# Altium schematic sheet SoC_PS_505_GTR.SchDoc: RFSoC AMC
size 420 x 297 mm; CompanyName: WUT; DrawnBy: T. Przywozki; Organization: WUT ISE; Address1: Warsaw University of Technology; Address2: Nowowiejska 15/19 00-665 Warsaw; Address3: Tomasz.Przywozki@pw.edu.pl; DocumentNumber: 11; Revision: 1; SheetNumber: 11; SheetTotal: 45; Project: RFSoC AMC; ModifiedBy: T. Przywozki; CreateDate: -; CheckedDate: -; DivGrp: ISE; Designer: T. Przywozki; ModifiedDate: -; ProjectName: ADC/DAC MEZZANINE
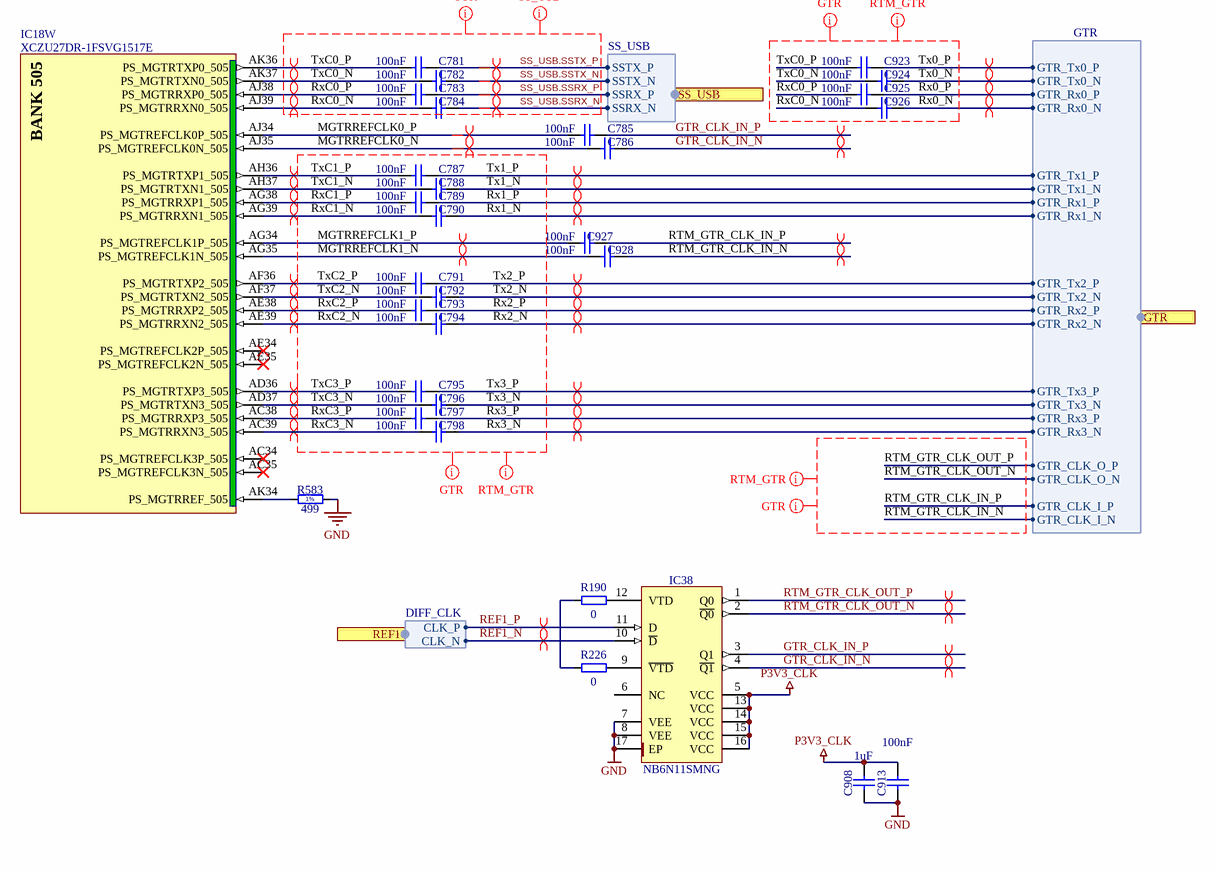
[diagram p0: SoC_PS_505_GTR.SchDoc]

## Parts
C781  100nF  [CAPC0603X33N]
C782  100nF  [CAPC0603X33N]
C783  100nF  [CAPC0603X33N]
C784  100nF  [CAPC0603X33N]
C785  100nF  [CAPC0603X33N]
C786  100nF  [CAPC0603X33N]
C787  100nF  [CAPC0603X33N]
C788  100nF  [CAPC0603X33N]
C789  100nF  [CAPC0603X33N]
C790  100nF  [CAPC0603X33N]
C791  100nF  [CAPC0603X33N]
C792  100nF  [CAPC0603X33N]
C793  100nF  [CAPC0603X33N]
C794  100nF  [CAPC0603X33N]
C795  100nF  [CAPC0603X33N]
C796  100nF  [CAPC0603X33N]
C797  100nF  [CAPC0603X33N]
C798  100nF  [CAPC0603X33N]
C908  1uF  [CAPC1005X55N]
C913  100nF  [CAPC0603X33N]
C923  100nF  [CAPC0603X33N]
C924  100nF  [CAPC0603X33N]
C925  100nF  [CAPC0603X33N]
C926  100nF  [CAPC0603X33N]
C927  100nF  [CAPC0603X33N]
C928  100nF  [CAPC0603X33N]
IC18  XCZU27DR-1FSVG1517E  [XILINX_FSVG1517 (XCZU27DR)]  (part W of 31)
IC38  NB6N11SMNG  [QFN50P300X300X100-17N-S185]
R190  0  [RESC1005X40N]
R226  0  [RESC1005X40N]
R583  499  [RESC1005X40N]

## Ports
GTR (harness GTR), REF1 (in, harness DIFF_CLK), SS_USB (harness SS_USB)

## Harnesses
DIFF_CLK: CLK_P, CLK_N
SS_USB: SSRX_P, SSTX_N, SSTX_P, SSRX_N
GTR: GTR_Tx0_P, GTR_Tx0_N, GTR_Rx0_P, GTR_Rx0_N, GTR_Rx1_P, GTR_Rx1_N, GTR_Tx1_P, GTR_Tx1_N, GTR_Rx2_P, GTR_Rx2_N, GTR_Tx2_P, GTR_Tx2_N, GTR_Rx3_P, GTR_Rx3_N, GTR_Tx3_P, GTR_Tx3_N, GTR_CLK_O_P, GTR_CLK_O_N, GTR_CLK_I_P, GTR_CLK_I_N

## Nets
GND: C908.2 C913.1 IC38.7(VEE) IC38.8(VEE) IC38.17(EP) R583.2
P3V3_CLK: C908.1 C913.2 IC38.5(VCC) IC38.13(VCC) IC38.14(VCC) IC38.15(VCC) IC38.16(VCC)
GTR_CLK_IN_N: C786.2 IC38.4(~{Q1})
GTR_CLK_IN_P: C785.2 IC38.3(Q1)
MGTRREFCLK0_N: C786.1 IC18.AJ35(PS_MGTREFCLK0N_505)
MGTRREFCLK0_P: C785.1 IC18.AJ34(PS_MGTREFCLK0P_505)
MGTRREFCLK1_N: C928.1 IC18.AG35(PS_MGTREFCLK1N_505)
MGTRREFCLK1_P: C927.1 IC18.AG34(PS_MGTREFCLK1P_505)
REF1_N: IC38.10(~{D}) ; port REF1.CLK_N
REF1_P: IC38.11(D) ; port REF1.CLK_P
RTM_GTR_CLK_IN_N: C928.2 ; port GTR.GTR_CLK_I_N
RTM_GTR_CLK_IN_P: C927.2 ; port GTR.GTR_CLK_I_P
RTM_GTR_CLK_OUT_N: IC38.2(~{Q0}) ; port GTR.GTR_CLK_O_N
RTM_GTR_CLK_OUT_P: IC38.1(Q0) ; port GTR.GTR_CLK_O_P
Rx0_N: C926.2 ; port GTR.GTR_Rx0_N
Rx0_P: C925.2 ; port GTR.GTR_Rx0_P
Rx1_N: C790.2 ; port GTR.GTR_Rx1_N
Rx1_P: C789.2 ; port GTR.GTR_Rx1_P
Rx2_N: C794.2 ; port GTR.GTR_Rx2_N
Rx2_P: C793.2 ; port GTR.GTR_Rx2_P
Rx3_N: C798.2 ; port GTR.GTR_Rx3_N
Rx3_P: C797.2 ; port GTR.GTR_Rx3_P
RxC0_N: C784.1 C926.1 IC18.AJ39(PS_MGTRRXN0_505)
RxC0_P: C783.1 C925.1 IC18.AJ38(PS_MGTRRXP0_505)
RxC1_N: C790.1 IC18.AG39(PS_MGTRRXN1_505)
RxC1_P: C789.1 IC18.AG38(PS_MGTRRXP1_505)
RxC2_N: C794.1 IC18.AE39(PS_MGTRRXN2_505)
RxC2_P: C793.1 IC18.AE38(PS_MGTRRXP2_505)
RxC3_N: C798.1 IC18.AC39(PS_MGTRRXN3_505)
RxC3_P: C797.1 IC18.AC38(PS_MGTRRXP3_505)
SS_USB.SSRX_N: C784.2 ; port SS_USB.SSRX_N
SS_USB.SSRX_P: C783.2 ; port SS_USB.SSRX_P
SS_USB.SSTX_N: C782.2 ; port SS_USB.SSTX_N
SS_USB.SSTX_P: C781.2 ; port SS_USB.SSTX_P
Tx0_N: C924.2 ; port GTR.GTR_Tx0_N
Tx0_P: C923.2 ; port GTR.GTR_Tx0_P
Tx1_N: C788.2 ; port GTR.GTR_Tx1_N
Tx1_P: C787.2 ; port GTR.GTR_Tx1_P
Tx2_N: C792.2 ; port GTR.GTR_Tx2_N
Tx2_P: C791.2 ; port GTR.GTR_Tx2_P
Tx3_N: C796.2 ; port GTR.GTR_Tx3_N
Tx3_P: C795.2 ; port GTR.GTR_Tx3_P
TxC0_N: C782.1 C924.1 IC18.AK37(PS_MGTRTXN0_505)
TxC0_P: C781.1 C923.1 IC18.AK36(PS_MGTRTXP0_505)
TxC1_N: C788.1 IC18.AH37(PS_MGTRTXN1_505)
TxC1_P: C787.1 IC18.AH36(PS_MGTRTXP1_505)
TxC2_N: C792.1 IC18.AF37(PS_MGTRTXN2_505)
TxC2_P: C791.1 IC18.AF36(PS_MGTRTXP2_505)
TxC3_N: C796.1 IC18.AD37(PS_MGTRTXN3_505)
TxC3_P: C795.1 IC18.AD36(PS_MGTRTXP3_505)
NetIC18_AK34: IC18.AK34(PS_MGTRREF_505) R583.1
NetIC38_9: IC38.9(~{VTD}) R226.2
NetIC38_12: IC38.12(VTD) R190.2
NetR190_1: R190.1 R226.1

Not connected (* = marked no-connect by the designer): IC18 AC34(PS_MGTREFCLK3P_505)* AC35(PS_MGTREFCLK3N_505)* AE34(PS_MGTREFCLK2P_505)* AE35(PS_MGTREFCLK2N_505)*; IC38 6(NC)

## Layout directives
differential pair: GTR_CLK_IN_N, GTR_CLK_IN_P, MGTRREFCLK0_N, MGTRREFCLK0_P, MGTRREFCLK1_N, MGTRREFCLK1_P, REF1_N, REF1_P, RTM_GTR_CLK_IN_N, RTM_GTR_CLK_IN_P, RTM_GTR_CLK_OUT_N, RTM_GTR_CLK_OUT_P, Rx0_N, Rx0_P, Rx1_N, Rx1_P, Rx2_N, Rx2_P, Rx3_N, Rx3_P, RxC0_N, RxC0_P, RxC1_N, RxC1_P, RxC2_N, RxC2_P, RxC3_N, RxC3_P, Tx0_N, Tx0_P, Tx1_N, Tx1_P, Tx2_N, Tx2_P, Tx3_N, Tx3_P, TxC0_N, TxC0_P, TxC1_N, TxC1_P, TxC2_N, TxC2_P, TxC3_N, TxC3_P
net class RTM_GTR: MGTRREFCLK1_N, MGTRREFCLK1_P, RTM_GTR_CLK_IN_N, RTM_GTR_CLK_IN_P, RTM_GTR_CLK_OUT_N, RTM_GTR_CLK_OUT_P, Rx0_N, Rx0_P, Rx1_N, Rx1_P, Rx2_N, Rx2_P, Rx3_N, Rx3_P, RxC0_N, RxC0_P, RxC1_N, RxC1_P, RxC2_N, RxC2_P, RxC3_N, RxC3_P, Tx0_N, Tx0_P, Tx1_N, Tx1_P, Tx2_N, Tx2_P, Tx3_N, Tx3_P, TxC0_N, TxC0_P, TxC1_N, TxC1_P, TxC2_N, TxC2_P, TxC3_N, TxC3_P
net class GTR; net class GT: MGTRREFCLK1_N, MGTRREFCLK1_P, RTM_GTR_CLK_IN_N, RTM_GTR_CLK_IN_P, RTM_GTR_CLK_OUT_N, RTM_GTR_CLK_OUT_P, Rx0_N, Rx0_P, Rx1_N, Rx1_P, Rx2_N, Rx2_P, Rx3_N, Rx3_P, RxC0_N, RxC0_P, RxC1_N, RxC1_P, RxC2_N, RxC2_P, RxC3_N, RxC3_P, SS_USB.SSRX_N, SS_USB.SSRX_P, SS_USB.SSTX_N, SS_USB.SSTX_P, Tx0_N, Tx0_P, Tx1_N, Tx1_P, Tx2_N, Tx2_P, Tx3_N, Tx3_P, TxC0_N, TxC0_P, TxC1_N, TxC1_P, TxC2_N, TxC2_P, TxC3_N, TxC3_P
net class SS_USB: RxC0_N, RxC0_P, SS_USB.SSRX_N, SS_USB.SSRX_P, SS_USB.SSTX_N, SS_USB.SSTX_P, TxC0_N, TxC0_P
differential pair; differential pair class 90ohm: SS_USB.SSRX_N, SS_USB.SSRX_P, SS_USB.SSTX_N, SS_USB.SSTX_P

## Notes on the sheet
- Project/Equipment
- Document
- Designer
- Drawn by
- Check.by
- Copyright WUT ISE 2021
  This documentation describes Open Hardware and is licensed under CERN OHL v.1.1. You may redistribute and modify this documentaction under the terms of the CERN OHL v1.1.
  (http://ohwr.org/CERNOHL). This documentation is dristributed WITHOUT ANY EXPRESS OR IMPLIED WARRANTY, INCLUDING OF MERCHANTABLITY, SATISFACTORY QUALITY AND FITNESS FOR A PARTICULAR PURPOSE. Please see the CERN OHL v.1.1 for applicable conditions
- File
- Last Mod.
- Print Date
- Sheet
- Size
- A3
- of
- Rev
- Contact:
- (in symbol R0402_499R_1%_0.1W_100PPM) 1%
- (in symbol XCZU27DR-1FSVG1517E, part W) BANK 505

## Library data of the parts
C781-C798 C923-C928 = CC0201_100NF_6.3V_10%_X5R: Non-polarised capacitor; Part Description: SMD Multilayer Chip Ceramic Capacitor; Manufacturer: GENERIC; Manufacturer1 Part Number: 02016D104KAT2A; Voltage: 6.3V; TC: X5R; Tolerance: ±10%; Part Number: CC0201_100NF_6.3V_10%_X5R; Component Kind: Standard; Component Type: Standard; Pin Count: 2; Value: 100nF; Status: Not Recommended; Manufacturer Part Number: CC0201_100NF_6.3V_10%_X5R; Case: 0201; Mounted: Yes; Socket: No; SMD: Yes; Sense: No; Manufacturer1 Example: AVX; Manufacturer1 ComponentHeight: 0.33mm; HelpURL: \\cern.ch\dfs\Applications\Altium\Datasheets\CC0201_X5R_AVX.pdf; Author: CERN DEM JLC; CreateDate: 03/12/2007; LatestRevisionDate: 03/12/2007
C908 = CC0402_1UF_16V_10%_X5R: Non-polarised capacitor; Manufacturer: GENERIC; Part Description: SMD Multilayer Chip Ceramic Capacitor; Manufacturer1 Part Number: C1005X5R1C105KT; Tolerance: ±10%; Voltage: 16V; TC: X5R; Manufacturer Part Number: CC0402_1UF_16V_10%_X5R; Part Number: CC0402_1UF_16V_10%_X5R; Value: 1uF; Component Kind: Standard; Component Type: Standard; Pin Count: 2; Status: Preferred; Case: 0402; Mounted: Yes; Socket: No; SMD: Yes; Sense: No; Manufacturer1 Example: TDK; Manufacturer1 ComponentHeight: 0.55mm; HelpURL: \\cern.ch\dfs\Applications\Altium\Datasheets\CC0402_X5R_TDK_C.pdf; Author: CERN DEM JLC; CreateDate: 25.10.2012; LatestRevisionDate: 25.10.2012
C913 = CC0201_100NF_6.3V_10%_X5R: Non-polarised capacitor; Manufacturer: GENERIC; Part Description: SMD Multilayer Chip Ceramic Capacitor; Manufacturer1 Part Number: 02016D104KAT2A; Tolerance: ±10%; Voltage: 6.3V; TC: X5R; Manufacturer Part Number: CC0201_100NF_6.3V_10%_X5R; Part Number: CC0201_100NF_6.3V_10%_X5R; Value: 100nF; Component Kind: Standard; Component Type: Standard; Pin Count: 2; Status: Not Recommended; Case: 0201; Mounted: Yes; Socket: No; SMD: Yes; Sense: No; Manufacturer1 Example: AVX; Manufacturer1 ComponentHeight: 0.33mm; HelpURL: \\cern.ch\dfs\Applications\Altium\Datasheets\CC0201_X5R_AVX.pdf; Author: CERN DEM JLC; CreateDate: 03.12.2007; LatestRevisionDate: 03.12.2007
IC18 = XCZU27DR-1FSVG1517E: Zynq UltraScale+ RFSoC, Quad-Core ARM® Cortex™-A53 MPCore™ up to 1.5GHz, 214 PS I/O, 299 HP I/O, 48 HD I/O, 1517-Pin BGA; Manufacturer: XILINX; PressFit: No; Bonding: No; Part Number: XCZU27DR-1FSVG1517E; Component Kind: Standard; Component Type: Standard; Device: XCZU27DR-1FSVG1517E; PackageDescription: BGA, 1.00mm Pitch, Square; 1517 Pin, 39 Columns X 39 Rows, 40.00mm X 40.00mm X 4.01mm H; Part Description: Zynq UltraScale+ RFSoC, Quad-Core ARM® Cortex™-A53 MPCore™ up to 1.5GHz, 214 PS I/O, 299 HP I/O, 48 HD I/O, 1517-Pin BGA; Manufacturer Part Number: XCZU27DR-1FSVG1517E; Pin Count: 1517; Case: BGA1517; Mounted: Yes; Socket: No; SMD: Yes; Sense: No; ComponentHeight: 4.01mm; HelpURL: \\cern.ch\dfs\Applications\Altium\Datasheets\XCZU27DR-1FSVG1517E.pdf; ComponentLink1URL: \\cern.ch\dfs\Applications\Altium\Datasheets\XCZU27DR-1FSVG1517E_Package-Pinout.pdf; ComponentLink1Description: Package/Pinout; ComponentLink2URL: \\cern.ch\dfs\Applications\Altium\Datasheets\XCZU27DR-1FSVG1517E_Pinout.pdf; ComponentLink2Description: Pinout; Author: CERN DEM MR; CreateDate: 02/05/2018; LatestRevisionDate: 02/05/2018
IC38 = NB6N11SMNG: 3.3V 1:2 AnyLevel Input to LVDS Fanout Buffer / Translator; Manufacturer: ON SEMICONDUCTOR; PressFit: No; Bonding: No; Part Number: NB6N11SMNG; Component Kind: Standard; Component Type: Standard; Device: NB6N11SMNG; PackageDescription: QFN, 0.50mm Pitch, Square; 16 Pin, 3.00mm L X 3.00mm W X 1.00mm H body (w/Thermal Tab 1.85 X 1.85mm), IPC Medium Density; Part Description: 3.3V 1:2 AnyLevel Input to LVDS Fanout Buffer / Translator; Manufacturer Part Number: NB6N11SMNG; Pin Count: 17; Case: QFN16; Mounted: Yes; Socket: No; SMD: Yes; Sense: No; ComponentHeight: 1mm; Author: CERN DEM JLC; HelpURL: \\cern.ch\dfs\Applications\Altium\Datasheets\NB6N11SMNG.pdf; CreateDate: 14.05.2013; LatestRevisionDate: 14.05.2013
R190 R226 = R0402_0R_JUMPER: Resistor; Part Description: 1A (0.05R Max DC Resistance) Zero Ohm Jumper; Manufacturer: GENERIC; Manufacturer1 Part Number: 232270591001L; PressFit: No; Part Number: R0402_0R_JUMPER; Component Kind: Standard; Component Type: Standard; Pin Count: 2; Value: 0; Status: Not Recommended; Manufacturer Part Number: R0402_0R_JUMPER; Case: 0402; Mounted: Yes; Sense: No; Socket: No; SMD: Yes; Manufacturer1 Example: YAGEO PHYCOMP; Manufacturer1 ComponentHeight: 0.4mm; HelpURL: \\cern.ch\dfs\Applications\Altium\Datasheets\R0402_Phycomp_RC0402.pdf; Author: CERN DEM JLC; CreateDate: 03.12.2007; LatestRevisionDate: 17.10.2012
R583 = R0402_499R_1%_0.1W_100PPM: Resistor - 1%; Part Description: General Purpose Thick Film Chip Resistor; Manufacturer: GENERIC; Manufacturer1 Part Number: ERJ2RKF4990X; Power: 0.1W; TC: ±100ppm/°C; Voltage: 50V; PressFit: No; Part Number: R0402_499R_1%_0.1W_100PPM; Component Kind: Standard; Component Type: Standard; Pin Count: 2; Value: 499; Status: Not Recommended; Tolerance: ±1%; Manufacturer Part Number: R0402_499R_1%_0.1W_100PPM; Case: 0402; Mounted: Yes; Sense: No; Socket: No; SMD: Yes; Manufacturer1 Example: PANASONIC; Manufacturer1 ComponentHeight: 0.4mm; HelpURL: \\cern.ch\dfs\Applications\Altium\Datasheets\R0402_PANASONIC_ERJ2RK.pdf; Author: CERN DEM MR; CreateDate: 22.11.2016; LatestRevisionDate: 22.11.2016